# Altium schematic sheet NAND_PullUp_OD.SchDoc
size A4
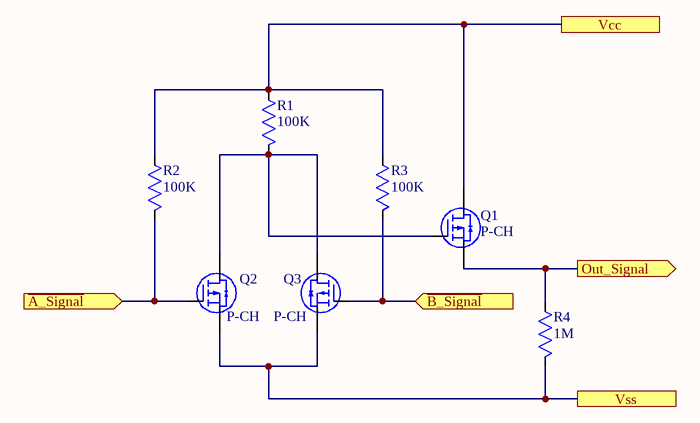
[diagram p0: NAND_PullUp_OD.SchDoc]

## Parts
Q1  Polarity: P-CH  [SOT-23]  (hidden comment: SI2301DS-T1)
Q2  Polarity: P-CH  [SOT-23]  (hidden comment: SI2301DS-T1)
Q3  Polarity: P-CH  [SOT-23]  (hidden comment: SI2301DS-T1)
R1  value 100K  [RES_0402]  (hidden comment: Res)
R2  value 100K  [RES_0402]  (hidden comment: Res)
R3  value 100K  [RES_0402]  (hidden comment: Res)
R4  value 1M  [RES_0402]  (hidden comment: Res)

## Ports
Out_Signal (out), Vcc, Vss, ~{A_Signal} (in), ~{B_Signal} (in)

## Nets
~{A_Signal}: Q2.2 R2.1 ; port ~{A_Signal}
~{B_Signal}: Q3.2 R3.1 ; port ~{B_Signal}
Out_Signal: Q1.3 R4.2 ; port Out_Signal
Vcc: Q1.1 R1.2 R2.2 R3.2 ; port Vcc
Vss: Q2.3 Q3.3 R4.1 ; port Vss
NetQ1_2: Q1.2 Q2.1 Q3.1 R1.1

## Library data of the parts
Q1-Q3 = SI2301DS-T1: Trans MOSFET P-CH 20V 2.3A 3-Pin TO-236 T/R; pin to pad: 1>2 2>1; Manufacturer: Vishay Siliconix; Rise Time: 36ns; Drain to Source Resistance: 130mR; Gate to Source Voltage (Vgs): 8V; Max Power Dissipation: 1.25W; Turn-Off Delay Time: 42ns; Turn-On Delay Time: 13ns; Number of Elements: 1; Element Configuration: Single; Drain to Source Voltage (Vdss): -20V; Supplier 1: Component Sense; Manufacturer Part Number: SI2301DS-T1; RoHS: No; Category: MOSFETs; Stock 1: 12531; Pricing 1: 143=0.17500, 500=0.15000, 1000=0.10000, 5000=0.09000, 10000=0.08000 (USD); Mount: Surface Mount; Case/Package: SOT-23-3; Number of Pins: 3; Weight: 0.050717oz; Min Operating Temperature: -55°C; Max Operating Temperature: 150°C; Packaging: Tape and Reel; Package Quantity: 3000; Continuous Drain Current (ID): 2.3A; Fall Time: 36ns; Power Dissipation: 1.25W; Number of Channels: 1; Length: 3.04mm; Height: 1.02mm; Width: 1.4mm; ComponentLink1URL: https://datasheet.ciiva.com/13048/70627-115154-13048148.pdf?src-supplier=Mouser; ComponentLink1Description: https://datasheet.ciiva.com/13048/70627-115154-13048148.pdf?src-supplier=Mouser; Supplier Part Number 1: SI2301DS-T1